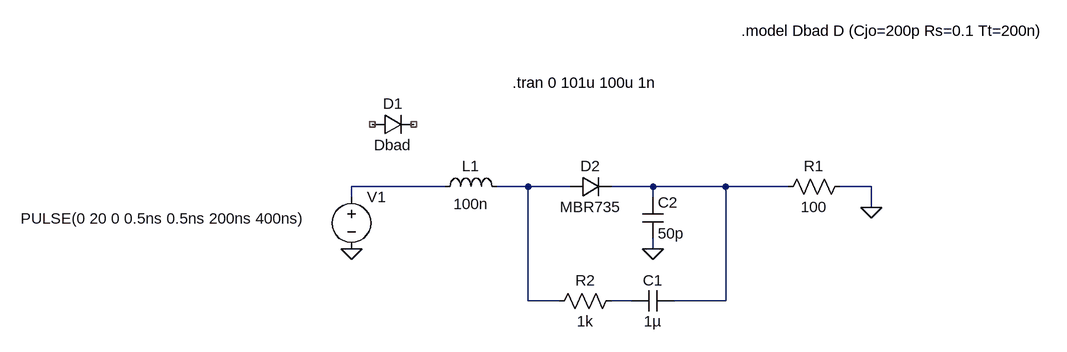
[diagram p0: schematic diode_ringing_sim.asc]
diode_ringing_sim.asc, the LTspice schematic file:
Version 4.1
SHEET 1 1096 680
WIRE 128 144 -16 144
WIRE 256 144 208 144
WIRE 320 144 256 144
WIRE 448 144 384 144
WIRE 560 144 448 144
WIRE 656 144 560 144
WIRE 784 144 736 144
WIRE -16 160 -16 144
WIRE 448 160 448 144
WIRE 784 176 784 144
WIRE 448 240 448 224
WIRE 256 320 256 144
WIRE 304 320 256 320
WIRE 416 320 384 320
WIRE 560 320 560 144
WIRE 560 320 480 320
FLAG 784 176 0
FLAG -16 240 0
FLAG 448 240 0
SYMBOL ind 112 160 R270
WINDOW 0 32 56 VTop 2
WINDOW 3 5 56 VBottom 2
SYMATTR InstName L1
SYMATTR Value 100n
SYMBOL cap 480 304 R90
WINDOW 0 0 32 VBottom 2
WINDOW 3 32 32 VTop 2
SYMATTR InstName C1
SYMATTR Value 1µ
SYMBOL voltage -16 144 R0
WINDOW 3 -509 49 Left 2
WINDOW 123 0 0 Left 0
WINDOW 39 0 0 Left 0
SYMATTR Value PULSE(0 20 0 0.5ns 0.5ns 200ns 400ns)
SYMATTR InstName V1
SYMBOL diode 16 64 R270
WINDOW 0 32 32 VTop 2
WINDOW 3 0 32 VBottom 2
SYMATTR InstName D1
SYMATTR Value Dbad
SYMBOL res 752 128 R90
WINDOW 0 0 56 VBottom 2
WINDOW 3 32 56 VTop 2
SYMATTR InstName R1
SYMATTR Value 100
SYMBOL cap 432 160 R0
SYMATTR InstName C2
SYMATTR Value 50p
SYMBOL res 400 304 R90
WINDOW 0 0 56 VBottom 2
WINDOW 3 32 56 VTop 2
SYMATTR InstName R2
SYMATTR Value 1k
SYMBOL diode 320 160 R270
WINDOW 0 32 32 VTop 2
WINDOW 3 0 32 VBottom 2
SYMATTR InstName D2
SYMATTR Value MBR735
SYMATTR Description Diode
SYMATTR Type diode
TEXT 232 -16 Left 2 !.tran 0 101u 100u 1n
TEXT 584 -96 Left 2 !.model Dbad D (Cjo=200p Rs=0.1 Tt=200n)

The netlist it stands for:
* diode_ringing_sim.asc
L1 N001 N002 100n
C1 N003 N004 1µ
V1 N001 0 PULSE(0 20 0 0.5ns 0.5ns 200ns 400ns)
D1 NC_01 NC_02 Dbad
R1 0 N003 100
C2 N003 0 50p
R2 N004 N002 1k
D2 N002 N003 MBR735
.model D D
.lib standard.dio
.tran 0 101u 100u 1n
.model Dbad D (Cjo=200p Rs=0.1 Tt=200n)
.backanno
.end